# Altium project controller_V1.1.PrjPcb
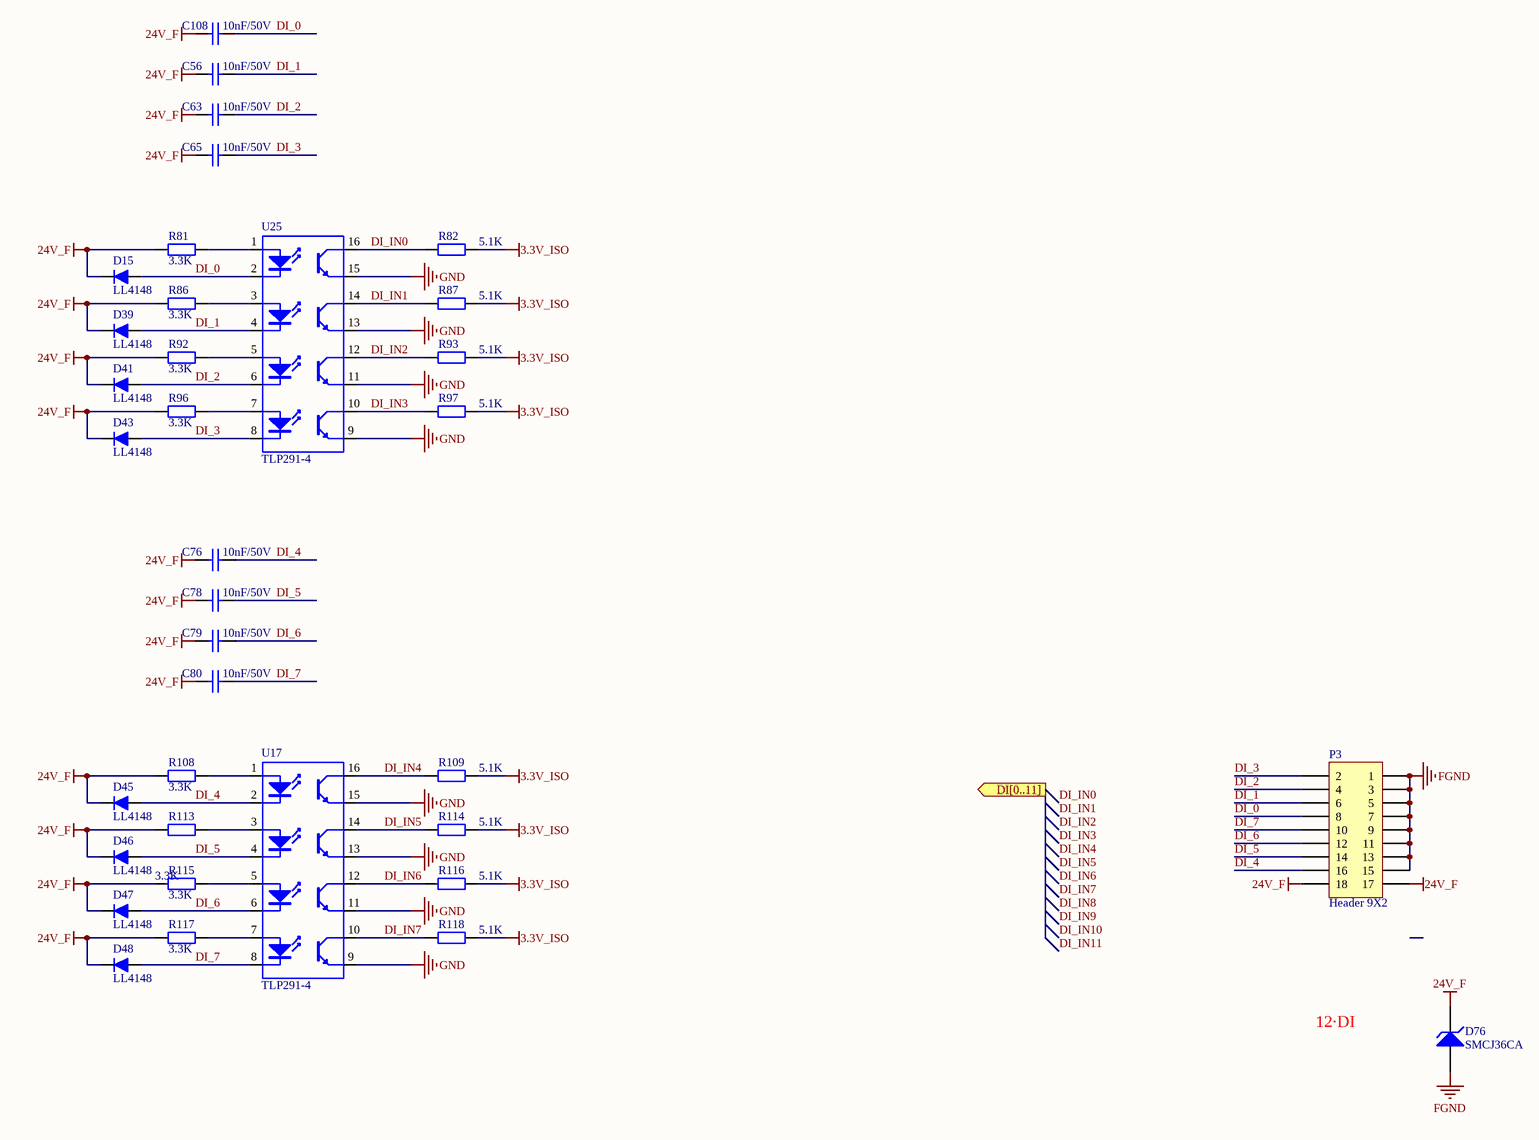
[diagram p0: di.SchDoc]
6 sheets, 311 parts. Net scope: global (net labels, ports and power ports of the same name join across sheets).
Board file: controller_V1.0.PcbDoc
Sheets:
  di.SchDoc
  do.SchDoc
  LTE.SchDoc
  power.SchDoc
  pt100.SchDoc
  rs485.SchDoc

## Sheet di.SchDoc
size A2

### Parts
C56  10nF/50V  [0603C]
C63  10nF/50V  [0603C]
C65  10nF/50V  [0603C]
C76  10nF/50V  [0603C]
C78  10nF/50V  [0603C]
C79  10nF/50V  [0603C]
C80  10nF/50V  [0603C]
C108  10nF/50V  [0603C]
D15  LL4148  [DO-213AB/LL34/MiniMELF]
D39  LL4148  [DO-213AB/LL34/MiniMELF]
D41  LL4148  [DO-213AB/LL34/MiniMELF]
D43  LL4148  [DO-213AB/LL34/MiniMELF]
D45  LL4148  [DO-213AB/LL34/MiniMELF]
D46  LL4148  [DO-213AB/LL34/MiniMELF]
D47  LL4148  [DO-213AB/LL34/MiniMELF]
D48  LL4148  [DO-213AB/LL34/MiniMELF]
D76  SMCJ36CA  [smc]
P3  Header 9X2  [XH2.54_2x9]
R81  3.3K  [0603R]
R82  5.1K  [0603R]
R86  3.3K  [0603R]
R87  5.1K  [0603R]
R92  3.3K  [0603R]
R93  5.1K  [0603R]
R96  3.3K  [0603R]
R97  5.1K  [0603R]
R108  3.3K  [0603R]
R109  5.1K  [0603R]
R113  3.3K  [0603R]
R114  5.1K  [0603R]
R115  3.3K  [0603R]
R116  5.1K  [0603R]
R117  3.3K  [0603R]
R118  5.1K  [0603R]
U17  TLP291-4  [SOP16-T]
U25  TLP291-4  [SOP16-T]

### Ports
DI[0..11] (out)

### Nets
3.3V_ISO: R82.1 R87.1 R93.1 R97.1 R109.1 R114.1 R116.1 R118.1
24V_F: C56.1 C63.1 C65.1 C76.1 C78.1 C79.1 C80.1 C108.1 D15.2(K) D39.2(K) D41.2(K) D43.2(K) D45.2(K) D46.2(K) D47.2(K) D48.2(K) D76.2(K) P3.17 P3.18 R81.2 R86.2 R92.2 R96.2 R108.2 R113.2 R115.2 R117.2
FGND: D76.1(A) P3.1 P3.3 P3.5 P3.7 P3.9 P3.11 P3.13 P3.15  [project net AGND]
GND: U17.9(E) U17.11(E) U17.13(E) U17.15(E) U25.9(E) U25.11(E) U25.13(E) U25.15(E)
DI_0: C108.2 D15.1(A) P3.8 U25.2(K)
DI_1: C56.2 D39.1(A) P3.6 U25.4(K)
DI_2: C63.2 D41.1(A) P3.4 U25.6(K)
DI_3: C65.2 D43.1(A) P3.2 U25.8(K)
DI_4: C76.2 D45.1(A) P3.16 U17.2(K)
DI_5: C78.2 D46.1(A) P3.14 U17.4(K)
DI_6: C79.2 D47.1(A) P3.12 U17.6(K)
DI_7: C80.2 D48.1(A) P3.10 U17.8(K)
DI_IN0: R82.2 U25.16(C)
DI_IN1: R87.2 U25.14(C)
DI_IN2: R93.2 U25.12(C)
DI_IN3: R97.2 U25.10(C)
DI_IN4: R109.2 U17.16(C)
DI_IN5: R114.2 U17.14(C)
DI_IN6: R116.2 U17.12(C)
DI_IN7: R118.2 U17.10(C)
NetR81_1: R81.1 U25.1(A)
NetR86_1: R86.1 U25.3(A)
NetR92_1: R92.1 U25.5(A)
NetR96_1: R96.1 U25.7(A)
NetR108_1: R108.1 U17.1(A)
NetR113_1: R113.1 U17.3(A)
NetR115_1: R115.1 U17.5(A)
NetR117_1: R117.1 U17.7(A)

### Notes on the sheet
- 12·DI
- Labels drawn without touching a wire or pin: DI_IN0, DI_IN1, DI_IN2, DI_IN3, DI_IN4, DI_IN5, DI_IN6, DI_IN7, DI_IN8, DI_IN9, DI_IN10, DI_IN11

### Library data of the parts
C56 C63 C65 C76 C78-C80 C108 = Cap: Capacitor; Value: 22nF; Published: 8-Jun-2000; LatestRevisionDate: 17-Jul-2002; LatestRevisionNote: Re-released for DXP Platform.; PackageReference: RAD-0.3; Publisher: Altium Limited; PackageDescription: Radial Cap, Thru-Hole; 2 Leads; 0.3 in Pin Spacing
D15 D39 D41 D43 D45-D48 = LL4148: VISHAY,LL4148,圆柱体MiniMELF100V/2A,ROHS; 版本: V1.00; 名称: 快速开关二极管; 物料编号: APLLY; 制造商: VISHAY
D76 = D Zener: SMBJ36CA; Published: 8-Jun-2000; LatestRevisionDate: 17-Jul-2002; LatestRevisionNote: Re-released for DXP Platform.; PackageReference: DIODE-0.7; Publisher: Altium Limited
P3 = Header 9X2: Header, 9-Pin, Dual row; LatestRevisionDate: 17-Jul-2002; LatestRevisionNote: Re-released for DXP Platform.; Publisher: Altium Limited
R81 R82 R86 R87 R92 R93 R96 R97 R108 R109 R113-R118 = Res0805M
U17 U25 = TLP281-4

## Sheet do.SchDoc
size A2
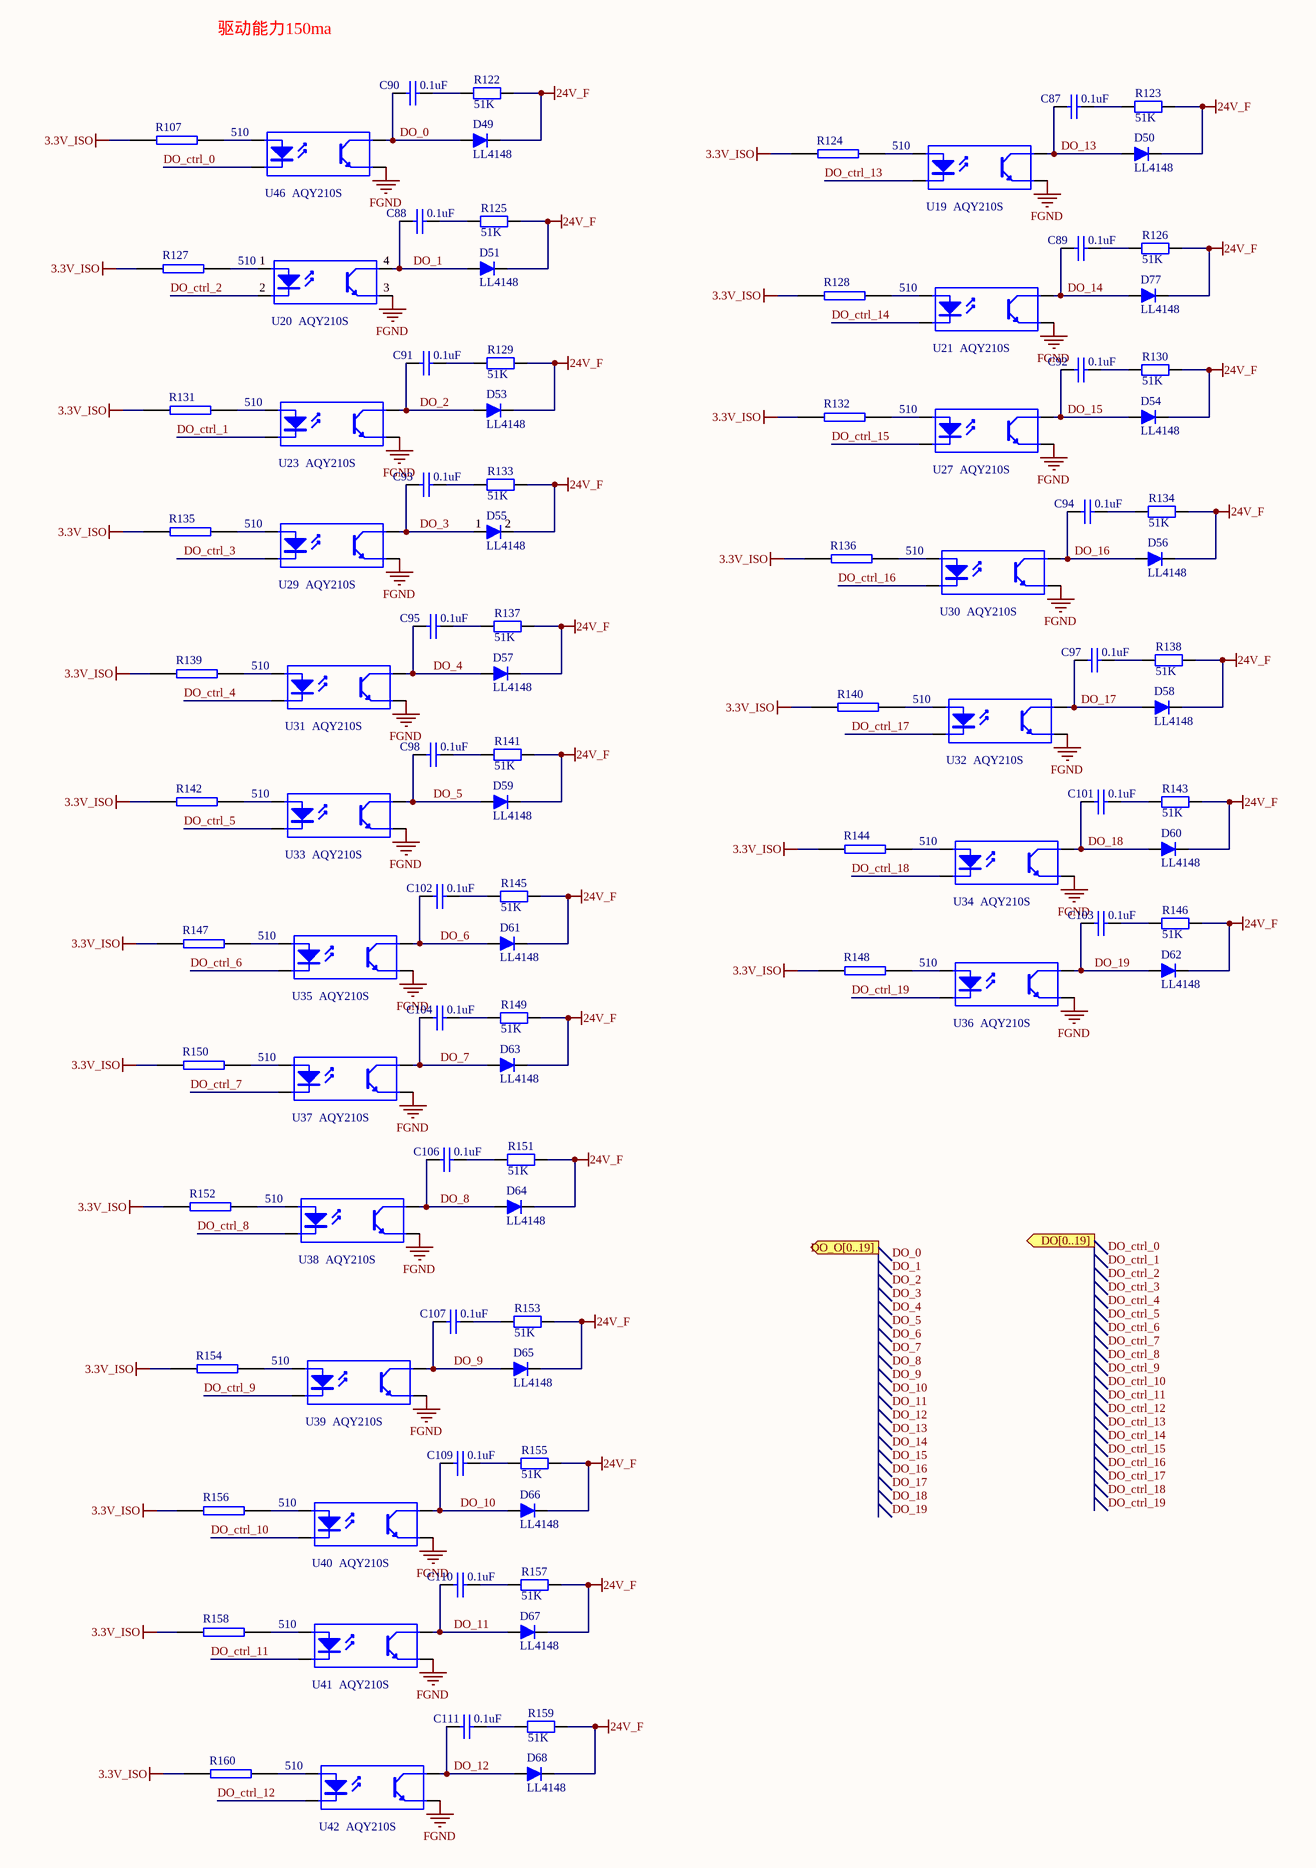
[diagram p1: do.SchDoc]

### Parts
C87  0.1uF  [0603C]
C88  0.1uF  [0603C]
C89  0.1uF  [0603C]
C90  0.1uF  [0603C]
C91  0.1uF  [0603C]
C92  0.1uF  [0603C]
C93  0.1uF  [0603C]
C94  0.1uF  [0603C]
C95  0.1uF  [0603C]
C97  0.1uF  [0603C]
C98  0.1uF  [0603C]
C101  0.1uF  [0603C]
C102  0.1uF  [0603C]
C103  0.1uF  [0603C]
C104  0.1uF  [0603C]
C106  0.1uF  [0603C]
C107  0.1uF  [0603C]
C109  0.1uF  [0603C]
C110  0.1uF  [0603C]
C111  0.1uF  [0603C]
D49  LL4148  [DO-213AB/LL34/MiniMELF]
D50  LL4148  [DO-213AB/LL34/MiniMELF]
D51  LL4148  [DO-213AB/LL34/MiniMELF]
D53  LL4148  [DO-213AB/LL34/MiniMELF]
D54  LL4148  [DO-213AB/LL34/MiniMELF]
D55  LL4148  [DO-213AB/LL34/MiniMELF]
D56  LL4148  [DO-213AB/LL34/MiniMELF]
D57  LL4148  [DO-213AB/LL34/MiniMELF]
D58  LL4148  [DO-213AB/LL34/MiniMELF]
D59  LL4148  [DO-213AB/LL34/MiniMELF]
D60  LL4148  [DO-213AB/LL34/MiniMELF]
D61  LL4148  [DO-213AB/LL34/MiniMELF]
D62  LL4148  [DO-213AB/LL34/MiniMELF]
D63  LL4148  [DO-213AB/LL34/MiniMELF]
D64  LL4148  [DO-213AB/LL34/MiniMELF]
D65  LL4148  [DO-213AB/LL34/MiniMELF]
D66  LL4148  [DO-213AB/LL34/MiniMELF]
D67  LL4148  [DO-213AB/LL34/MiniMELF]
D68  LL4148  [DO-213AB/LL34/MiniMELF]
D77  LL4148  [DO-213AB/LL34/MiniMELF]
R107  510  [0603R]
R122  51K  [0603R]
R123  51K  [0603R]
R124  510  [0603R]
R125  51K  [0603R]
R126  51K  [0603R]
R127  510  [0603R]
R128  510  [0603R]
R129  51K  [0603R]
R130  51K  [0603R]
R131  510  [0603R]
R132  510  [0603R]
R133  51K  [0603R]
R134  51K  [0603R]
R135  510  [0603R]
R136  510  [0603R]
R137  51K  [0603R]
R138  51K  [0603R]
R139  510  [0603R]
R140  510  [0603R]
R141  51K  [0603R]
R142  510  [0603R]
R143  51K  [0603R]
R144  510  [0603R]
R145  51K  [0603R]
R146  51K  [0603R]
R147  510  [0603R]
R148  510  [0603R]
R149  51K  [0603R]
R150  510  [0603R]
R151  51K  [0603R]
R152  510  [0603R]
R153  51K  [0603R]
R154  510  [0603R]
R155  51K  [0603R]
R156  510  [0603R]
R157  51K  [0603R]
R158  510  [0603R]
R159  51K  [0603R]
R160  510  [0603R]
U19  AQY210S  [sop4]
U20  AQY210S  [sop4]
U21  AQY210S  [sop4]
U23  AQY210S  [sop4]
U27  AQY210S  [sop4]
U29  AQY210S  [sop4]
U30  AQY210S  [sop4]
U31  AQY210S  [sop4]
U32  AQY210S  [sop4]
U33  AQY210S  [sop4]
U34  AQY210S  [sop4]
U35  AQY210S  [sop4]
U36  AQY210S  [sop4]
U37  AQY210S  [sop4]
U38  AQY210S  [sop4]
U39  AQY210S  [sop4]
U40  AQY210S  [sop4]
U41  AQY210S  [sop4]
U42  AQY210S  [sop4]
U46  AQY210S  [sop4]

### Ports
DO[0..19] (out), DO_O[0..19] (out)

### Nets
3.3V_ISO: R107.2 R124.2 R127.2 R128.2 R131.2 R132.2 R135.2 R136.2 R139.2 R140.2 R142.2 R144.2 R147.2 R148.2 R150.2 R152.2 R154.2 R156.2 R158.2 R160.2
24V_F: D49.2(K) D50.2(K) D51.2(K) D53.2(K) D54.2(K) D55.2(K) D56.2(K) D57.2(K) D58.2(K) D59.2(K) D60.2(K) D61.2(K) D62.2(K) D63.2(K) D64.2(K) D65.2(K) D66.2(K) D67.2(K) D68.2(K) D77.2(K) R122.2 R123.2 R125.2 R126.2 R129.2 R130.2 R133.2 R134.2 R137.2 R138.2 R141.2 R143.2 R145.2 R146.2 R149.2 R151.2 R153.2 R155.2 R157.2 R159.2
FGND: U19.3(E) U20.3(E) U21.3(E) U23.3(E) U27.3(E) U29.3(E) U30.3(E) U31.3(E) U32.3(E) U33.3(E) U34.3(E) U35.3(E) U36.3(E) U37.3(E) U38.3(E) U39.3(E) U40.3(E) U41.3(E) U42.3(E) U46.3(E)  [project net AGND]
DO_0: C90.1 D49.1(A) U46.4(C)
DO_1: C88.1 D51.1(A) U20.4(C)
DO_2: C91.1 D53.1(A) U23.4(C)
DO_3: C93.1 D55.1(A) U29.4(C)
DO_4: C95.1 D57.1(A) U31.4(C)
DO_5: C98.1 D59.1(A) U33.4(C)
DO_6: C102.1 D61.1(A) U35.4(C)
DO_7: C104.1 D63.1(A) U37.4(C)
DO_8: C106.1 D64.1(A) U38.4(C)
DO_9: C107.1 D65.1(A) U39.4(C)
DO_10: C109.1 D66.1(A) U40.4(C)
DO_11: C110.1 D67.1(A) U41.4(C)
DO_12: C111.1 D68.1(A) U42.4(C)
DO_13: C87.1 D50.1(A) U19.4(C)
DO_14: C89.1 D77.1(A) U21.4(C)
DO_15: C92.1 D54.1(A) U27.4(C)
DO_16: C94.1 D56.1(A) U30.4(C)
DO_17: C97.1 D58.1(A) U32.4(C)
DO_18: C101.1 D60.1(A) U34.4(C)
DO_19: C103.1 D62.1(A) U36.4(C)
DO_ctrl_0: U46.2(K)
DO_ctrl_1: U23.2(K)
DO_ctrl_2: U20.2(K)
DO_ctrl_3: U29.2(K)
DO_ctrl_4: U31.2(K)
DO_ctrl_5: U33.2(K)
DO_ctrl_6: U35.2(K)
DO_ctrl_7: U37.2(K)
DO_ctrl_8: U38.2(K)
DO_ctrl_9: U39.2(K)
DO_ctrl_10: U40.2(K)
DO_ctrl_11: U41.2(K)
DO_ctrl_12: U42.2(K)
DO_ctrl_13: U19.2(K)
DO_ctrl_14: U21.2(K)
DO_ctrl_15: U27.2(K)
DO_ctrl_16: U30.2(K)
DO_ctrl_17: U32.2(K)
DO_ctrl_18: U34.2(K)
DO_ctrl_19: U36.2(K)
NetC87_2: C87.2 R123.1
NetC88_2: C88.2 R125.1
NetC89_2: C89.2 R126.1
NetC90_2: C90.2 R122.1
NetC91_2: C91.2 R129.1
NetC92_2: C92.2 R130.1
NetC93_2: C93.2 R133.1
NetC94_2: C94.2 R134.1
NetC95_2: C95.2 R137.1
NetC97_2: C97.2 R138.1
NetC98_2: C98.2 R141.1
NetC101_2: C101.2 R143.1
NetC102_2: C102.2 R145.1
NetC103_2: C103.2 R146.1
NetC104_2: C104.2 R149.1
NetC106_2: C106.2 R151.1
NetC107_2: C107.2 R153.1
NetC109_2: C109.2 R155.1
NetC110_2: C110.2 R157.1
NetC111_2: C111.2 R159.1
NetR107_1: R107.1 U46.1(A)
NetR124_1: R124.1 U19.1(A)
NetR127_1: R127.1 U20.1(A)
NetR128_1: R128.1 U21.1(A)
NetR131_1: R131.1 U23.1(A)
NetR132_1: R132.1 U27.1(A)
NetR135_1: R135.1 U29.1(A)
NetR136_1: R136.1 U30.1(A)
NetR139_1: R139.1 U31.1(A)
NetR140_1: R140.1 U32.1(A)
NetR142_1: R142.1 U33.1(A)
NetR144_1: R144.1 U34.1(A)
NetR147_1: R147.1 U35.1(A)
NetR148_1: R148.1 U36.1(A)
NetR150_1: R150.1 U37.1(A)
NetR152_1: R152.1 U38.1(A)
NetR154_1: R154.1 U39.1(A)
NetR156_1: R156.1 U40.1(A)
NetR158_1: R158.1 U41.1(A)
NetR160_1: R160.1 U42.1(A)

### Notes on the sheet
- 驱动能力150ma
- Labels drawn without touching a wire or pin: DO_0, DO_1, DO_2, DO_3, DO_4, DO_5, DO_6, DO_7, DO_8, DO_9, DO_10, DO_11, DO_12, DO_13, DO_14, DO_15, DO_16, DO_17, DO_18, DO_19, DO_ctrl_0, DO_ctrl_1, DO_ctrl_2, DO_ctrl_3, DO_ctrl_4, DO_ctrl_5, DO_ctrl_6, DO_ctrl_7, DO_ctrl_8, DO_ctrl_9, DO_ctrl_10, DO_ctrl_11, DO_ctrl_12, DO_ctrl_13, DO_ctrl_14, DO_ctrl_15, DO_ctrl_16, DO_ctrl_17, DO_ctrl_18, DO_ctrl_19

### Library data of the parts
C87-C95 C97 C98 C101-C104 C106 C107 C109-C111 = CAP: Capacitor
D49-D51 D53-D68 D77 = LL4148: as D15 on sheet di; 制造商: VISHAY
R107 R124 R127 R128 R131 R132 R135 R136 R139 R140 R142 R144 R147 R148 R150 R152 R154 R156 R158 R160 = RES2
R122 R123 R125 R126 R129 R130 R133 R134 R137 R138 R141 R143 R145 R146 R149 R151 R153 R155 R157 R159 = Res0805M
U19-U21 U23 U27 U29-U42 U46 = Optoisolator1: 4-Pin Phototransistor Optocoupler; Published: 24-Mar-1999; LatestRevisionDate: 04-Mar-2005; LatestRevisionNote: Sch pins 3 & 4 Swapped.; DatasheetVersion: Nov-2003; PackageReference: DIP-4; Publisher: Altium Limited

## Sheet LTE.SchDoc
size A3
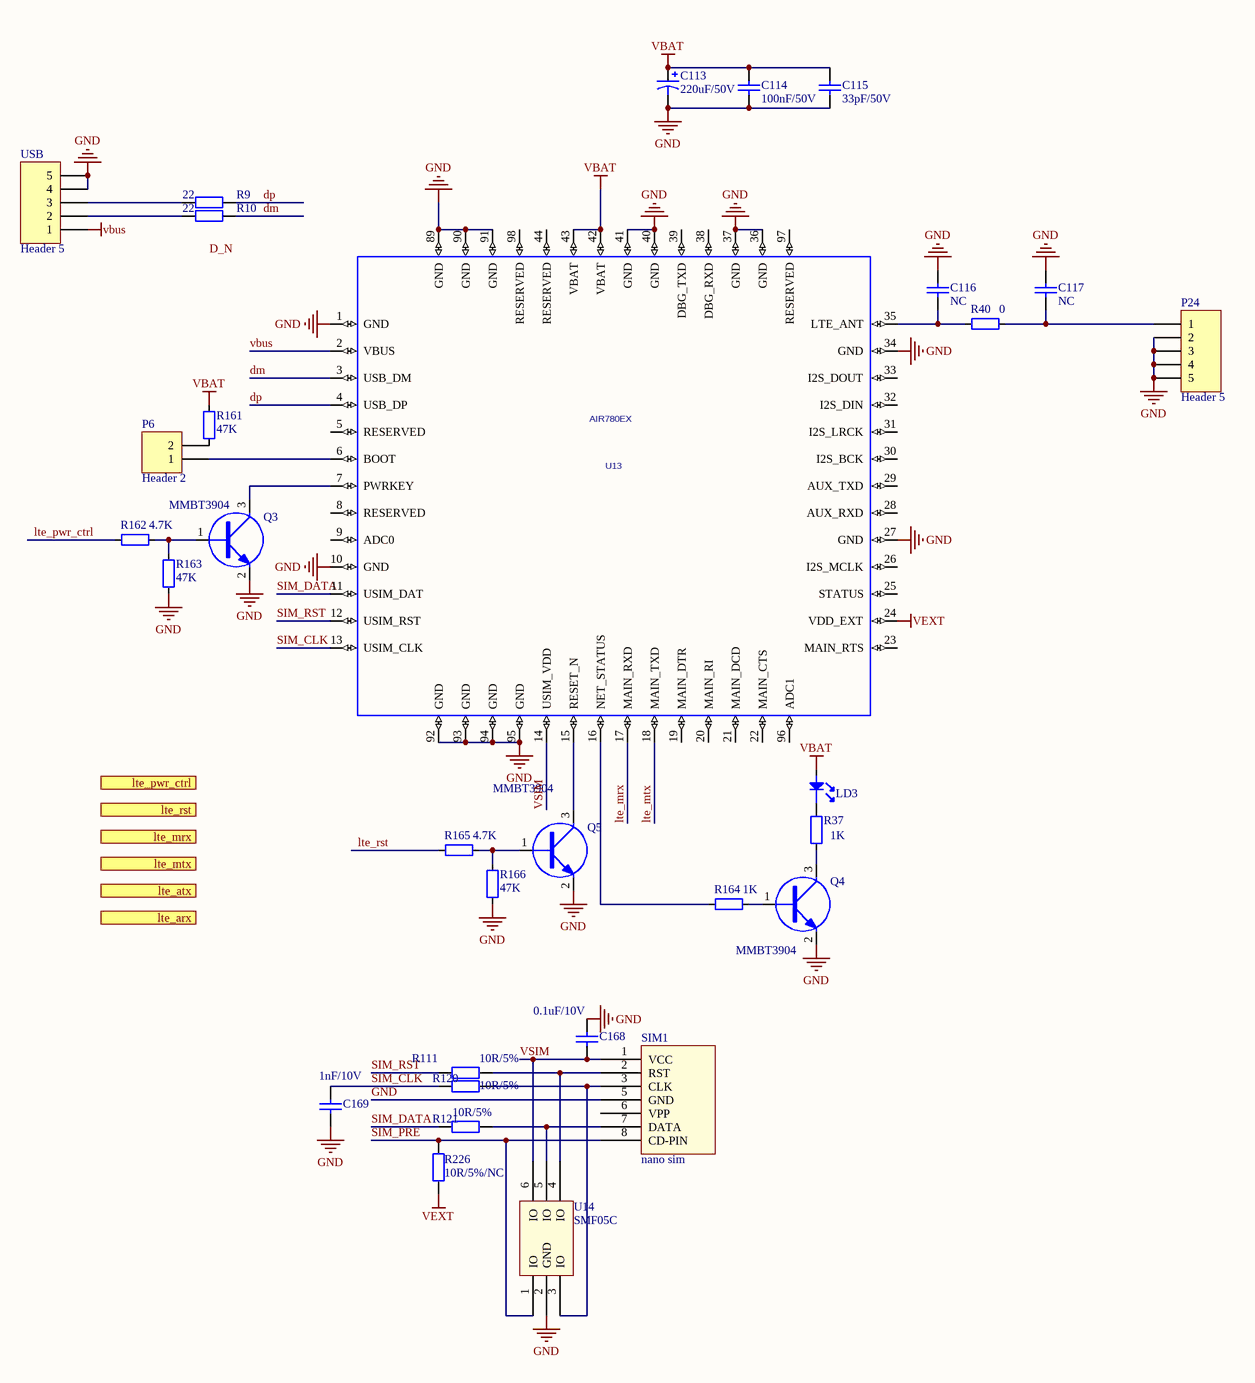
[diagram p2: LTE.SchDoc]

### Parts
C113  220uF/50V  [Φ10×10]
C114  100nF/50V  [0603C]
C115  33pF/50V  [0603C]
C116  NC  [0603c]
C117  NC  [0603c]
C168  0.1uF/10V  [0603c]
C169  1nF/10V  [0603c]
LD3  LED_Green_19-217  [0603led]  (value not drawn)
P6  Header 2  [HDR1X2]
P24  Header 5  [KH-SMA-KE-Z]
Q3  MMBT3904  [SOT23-3]
Q4  MMBT3904  [SOT23-3]
Q5  MMBT3904  [SOT23-3]
R9  22  [0402R]
R10  22  [0402R]
R37  1K  [0603R]
R40  0  [0603r]
R111  10R/5%  [0603r]
R120  10R/5%  [0603r]
R121  10R/5%  [0603r]
R161  47K  [0603r]
R162  4.7K  [0603R]
R163  47K  [0603r]
R164  1K  [0603r]
R165  4.7K  [0603R]
R166  47K  [0603r]
R226  10R/5%/NC  [0603r]
SIM1  nano sim  [Nano SIM]
U13  AIR780EX  [AIR780EX]
U14  SMF05C  [sc70-6l]
USB  Header 5  [USB-MICRO-5P]

### Ports
lte_arx, lte_atx, lte_mrx, lte_mtx, lte_pwr_ctrl, lte_rst

### Nets
GND: C113.2 C114.1 C115.1 C116.2 C117.2 C168.1 C169.2 P24.2 P24.3 P24.4 P24.5 Q3.2(E) Q4.2(E) Q5.2(E) R163.1 R166.1 SIM1.5(GND) U13.1(GND) U13.10(GND) U13.27(GND) U13.34(GND) U13.36(GND) U13.37(GND) U13.40(GND) U13.41(GND) U13.89(GND) U13.90(GND) U13.91(GND) U13.92(GND) U13.93(GND) U13.94(GND) U13.95(GND) U14.2(GND) USB.4 USB.5
VBAT: C113.1 C114.2 C115.2 LD3.1 R161.2 U13.42(VBAT) U13.43(VBAT)
vbus: U13.2(VBUS) USB.1
VEXT: R226.2 U13.24(VDD_EXT)
dm: R10.2 U13.3(USB_DM)
dp: R9.2 U13.4(USB_DP)
lte_mrx: U13.17(MAIN_RXD)
lte_mtx: U13.18(MAIN_TXD)
lte_pwr_ctrl: R162.1
lte_rst: R165.1
SIM_CLK: C169.1 R120.2 U13.13(USIM_CLK)
SIM_DATA: R121.2 U13.11(USIM_DAT)
SIM_PRE: R226.1 SIM1.8(CD-PIN) U14.1(IO)
SIM_RST: R111.2 U13.12(USIM_RST)
VSIM: C168.2 SIM1.1(VCC) U13.14(USIM_VDD) U14.6(IO)
NetC116_1: C116.1 R40.1 U13.35(LTE_ANT)
NetC117_1: C117.1 P24.1 R40.2
NetLD3_2: LD3.2 R37.1
NetP6_1: P6.1 U13.6(BOOT)
NetP6_2: P6.2 R161.1
NetQ3_1: Q3.1(B) R162.2 R163.2
NetQ3_3: Q3.3(C) U13.7(PWRKEY)
NetQ4_1: Q4.1(B) R164.2
NetQ4_3: Q4.3(C) R37.2
NetQ5_1: Q5.1(B) R165.2 R166.2
NetQ5_3: Q5.3(C) U13.15(RESET_N)
NetR9_1: R9.1 USB.3
NetR10_1: R10.1 USB.2
NetR111_1: R111.1 SIM1.2(RST) U14.4(IO)
NetR120_1: R120.1 SIM1.3(CLK) U14.3(IO)
NetR121_1: R121.1 SIM1.7(DATA) U14.5(IO)
NetR164_1: R164.1 U13.16(NET_STATUS)

Not connected (* = marked no-connect by the designer): SIM1 6(VPP); U13 5(RESERVED) 8(RESERVED) 9(ADC0) 19(MAIN_DTR) 20(MAIN_RI) 21(MAIN_DCD) 22(MAIN_CTS) 23(MAIN_RTS) 25(STATUS) 26(I2S_MCLK) 28(AUX_RXD) 29(AUX_TXD) 30(I2S_BCK) 31(I2S_LRCK) 32(I2S_DIN) 33(I2S_DOUT) 38(DBG_RXD) 39(DBG_TXD) 44(RESERVED) 96(ADC1) 97(RESERVED) 98(RESERVED)

### Notes on the sheet
- Labels drawn without touching a wire or pin: D_N

### Library data of the parts
C113 = Cap Pol1: Polarized Capacitor (Radial); Value: 100pF; Published: 8-Jun-2000; LatestRevisionDate: 17-Jul-2002; LatestRevisionNote: Re-released for DXP Platform.; PackageReference: RB7.6-15; Publisher: Altium Limited
C114-C117 = Cap: Capacitor; Value: 22nF; Published: 8-Jun-2000; LatestRevisionDate: 17-Jul-2002; LatestRevisionNote: Re-released for DXP Platform.; PackageReference: RAD-0.3; Publisher: Altium Limited; PackageDescription: Radial Cap, Thru-Hole; 2 Leads; 0.3 in Pin Spacing
C168 = Cap: Capacitor; Published: 8-Jun-2000; LatestRevisionDate: 17-Jul-2002; LatestRevisionNote: Re-released for DXP Platform.; PackageReference: RAD-0.3; Publisher: Altium Limited; Value: 0.1uF/10V
C169 = Cap: Capacitor; Value: 0.1uF/10V; Published: 8-Jun-2000; LatestRevisionDate: 17-Jul-2002; LatestRevisionNote: Re-released for DXP Platform.; PackageReference: RAD-0.3; Publisher: Altium Limited
LD3 = LED_Green_19-217: 物料主编码(PN): 100000032; Value: 19-217/G7C-AN1P2/3T; ID: 6; 序号: 33; 物料名称: 绿色LED; 物料描述: Other,LED,绿色,0603,1.6X0.8X0.4mm,19-217/G7C-AN1P2/3T; 工作温度: –40°C to 85°C; 制造商: Everlight; 器件等级: ——; 物料类型: 特殊二极管; 规格型号(完整型号): 19-217/G7C-AN1P2/3T
P6 = Header 2: Header, 2-Pin; LatestRevisionDate: 17-Jul-2002; LatestRevisionNote: Re-released for DXP Platform.; Publisher: Altium Limited
P24 USB = Header 5: Header, 5-Pin; LatestRevisionDate: 17-Jul-2002; LatestRevisionNote: Re-released for DXP Platform.; Publisher: Altium Limited
Q3-Q5 = NPN_MMBT3904
R9 R10 = Resistor: Resistor SMD - IEC symbol version; Value: NC; LatestRevisionDate: 27-Jul-20  -  Semtech
R37 R164 = RES0603: 物料主编码(PN): 150000040; ID: 233; 序号: 109; 物料名称: 贴片电阻; 精度: ±1%; 规格型号(完整型号): RC1608F103CS/RC0603FR-0710KL; 物料描述: RES,贴片电阻,0603,10k,±1%,1/10W,1.6X0.8X0.45mm,RC1608F103CS/RC0603FR-0710KL; 工作温度: –55°C to 155°C; 制造商: 三星/YAGEO; 器件等级: ——; 物料类型: 表贴电阻; 参数值: 1.00E+04; Value: 1K
R40 R161-R163 R165 R166 = RES0603: 物料主编码(PN): 150000040; Value: 1K; ID: 233; 序号: 109; 物料名称: 贴片电阻; 精度: ±1%; 规格型号(完整型号): RC1608F103CS/RC0603FR-0710KL; 物料描述: RES,贴片电阻,0603,10k,±1%,1/10W,1.6X0.8X0.45mm,RC1608F103CS/RC0603FR-0710KL; 工作温度: –55°C to 155°C; 制造商: 三星/YAGEO; 器件等级: ——; 物料类型: 表贴电阻; 参数值: 1.00E+04
R111 R120 R121 R226 = Res2: Resistor; Value: 10R; Published: 8-Jun-2000; LatestRevisionDate: 17-Jul-2002; LatestRevisionNote: Re-released for DXP Platform.; PackageReference: AXIAL-0.4; Publisher: Altium Limited
U13 = AIR780EX: PCB DECAL: AIR780EX

## Sheet power.SchDoc
size A2
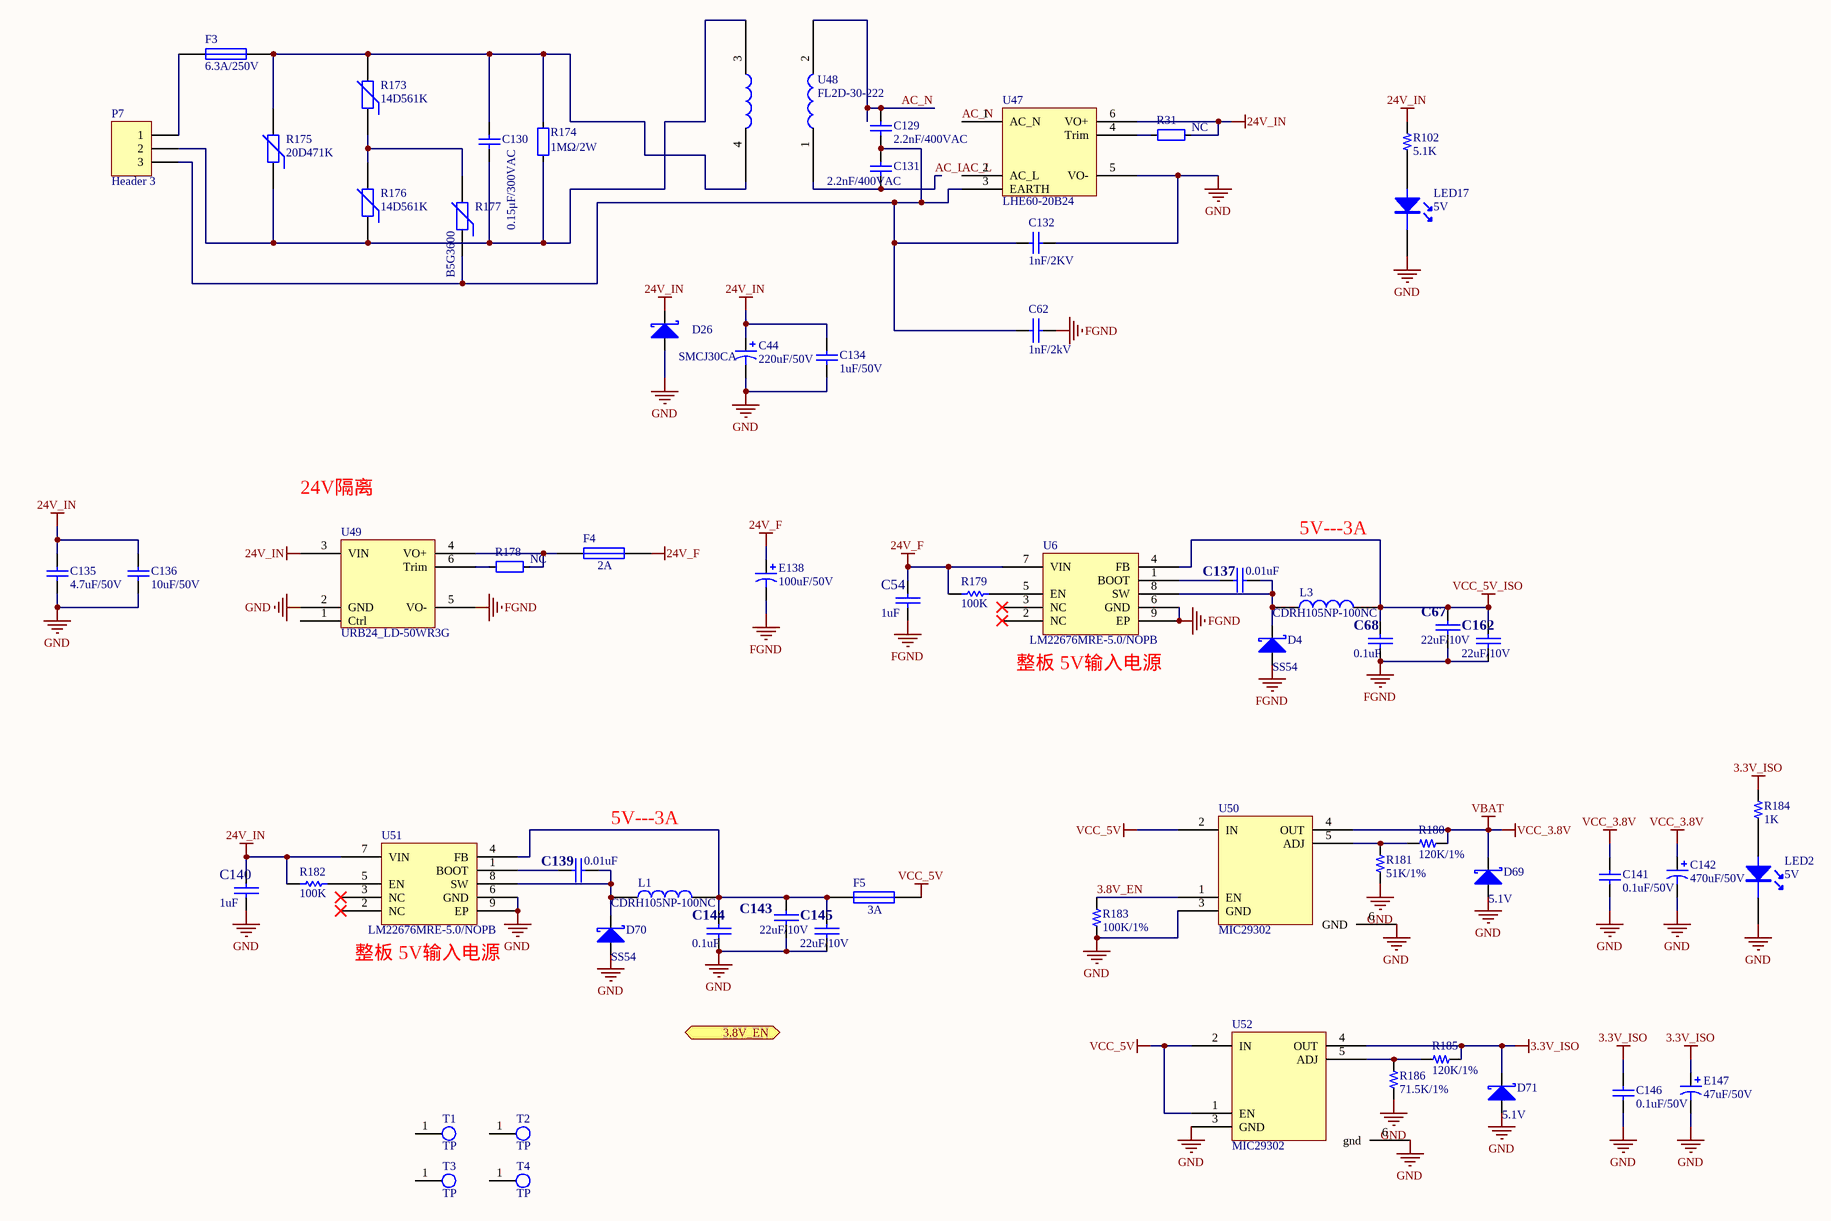
[diagram p3: power.SchDoc]

### Parts
C44  220uF/50V  [Φ10×10]
C54  1uF  [0603C]
C62  1nF/2kV  [1206C]
C67  22uF/10V  [1210C]
C68  0.1uF  [0603C]
C129  2.2nF/400VAC  [15x18]
C130  0.15μF/300VAC  [15x18]
C131  2.2nF/400VAC  [15x18]
C132  1nF/2KV  [1206C]
C134  1uF/50V  [1210C]
C135  4.7uF/50V  [1210C]
C136  10uF/50V  [1210C]
C137  0.01uF  [0603C]
C139  0.01uF  [0603C]
C140  1uF  [0603C]
C141  0.1uF/50V  [0603C]
C142  470uF/50V  [Φ10×10]
C143  22uF/10V  [1210C]
C144  0.1uF  [0603C]
C145  22uF/10V  [1210C]
C146  0.1uF/50V  [0603C]
C162  22uF/10V  [1210C]
D4  SS54  [SMC]
D26  SMCJ30CA  [SMC]
D69  5.1V  [SMA]
D70  SS54  [SMC]
D71  5.1V  [SMA]
E138  100uF/50V  [Φ10×10]
E147  47uF/50V  [Φ10×10]
F3  6.3A/250V  [可视开关电源保险丝座]
F4  2A  [1812-F]
F5  3A  [1812-F]
L1  CDRH105NP-100NC  [CDRH105]
L3  CDRH105NP-100NC  [CDRH105]
LED2  5V  [0603LED]
LED17  5V  [0603LED]
P7  Header 3  [KF128V-3P]
R31  NC  [0603r]
R102  5.1K  [0603R]
R173  14D561K  [14D561K]
R174  1MΩ/2W  [5x15.5]
R175  20D471K  [20D471K]
R176  14D561K  [14D561K]
R177  B5G3600  [B5G3600]
R178  NC  [0603r]
R179  100K  [0603R]
R180  120K/1%  [0603R]
R181  51K/1%  [0603R]
R182  100K  [0603R]
R183  100K/1%  [0603R]
R184  1K  [0603R]
R185  120K/1%  [0603R]
R186  71.5K/1%  [0603R]
T1  TP  [m2.5]
T2  TP  [m2.5]
T3  TP  [m2.5]
T4  TP  [m2.5]
U6  LM22676MRE-5.0/NOPB  [SOP127P600X168_HS-8N]
U47  LHE60-20B24  [LHE60-20B24]
U48  FL2D-30-222  [TY-100P]
U49  URB24_LD-50WR3G  [URB24_LD-50WR3G]
U50  MIC29302  [TO228P1435X457-6N]
U51  LM22676MRE-5.0/NOPB  [SOP127P600X168_HS-8N]
U52  MIC29302  [TO228P1435X457-6N]

### Ports
3.8V_EN (in)

### Nets
3.3V_ISO: C146.2 D71.2(K) E147.1 R184.2 R185.1 U52.4(OUT)
24V_F: C54.2 E138.1 F4.2 R179.2 U6.7(VIN)
24V_IN: C44.1 C134.2 C135.2 C136.2 C140.2 D26.2(K) R31.2 R102.2 R182.2 U47.6(VO+) U49.3(VIN) U51.7(VIN)
FGND: C54.1 C62.1 C67.2 C68.2 C162.2 D4.1(A) E138.2 U6.6(GND) U6.9(EP) U49.5(VO-)  [project net AGND]
GND: C44.2 C132.1 C134.1 C135.1 C136.1 C140.1 C141.1 C142.2 C143.2 C144.2 C145.2 C146.1 D26.1(A) D69.1(A) D70.1(A) D71.1(A) E147.2 LED2.2 LED17.2 R181.1 R183.1 R186.1 U47.5(VO-) U49.2(GND) U50.3(GND) U50.6(GND) U51.6(GND) U51.9(EP) U52.3(GND) U52.6(gnd)
VBAT: C141.2 C142.1 D69.2(K) R180.1 U50.4(OUT)  [also labelled VCC_3.8V]
VCC_5V: F5.2 U50.2(IN) U52.1(EN) U52.2(IN)
VCC_5V_ISO: C67.1 C68.1 C162.1 L3.2 U6.4(FB)
3.8V_EN: R183.2 U50.1(EN)
AC_L: C131.1 U47.2(AC_L) U48.1(L)
AC_N: C129.2 U47.1(AC_N) U48.2(L)
NetC62_2: C62.2 C129.1 C131.2 C132.2 P7.3 R177.1 U47.3(EARTH)
NetC130_1: C130.1 P7.2 R174.2 R175.1 R176.1 U48.3(L)
NetC130_2: C130.2 F3.2 R173.2 R174.1 R175.2 U48.4
NetC137_1: C137.1 D4.2(K) L3.1 U6.8(SW)
NetC137_2: C137.2 U6.1(BOOT)
NetC139_1: C139.1 D70.2(K) L1.1 U51.8(SW)
NetC139_2: C139.2 U51.1(BOOT)
NetC143_1: C143.1 C144.1 C145.1 F5.1 L1.2 U51.4(FB)
NetF3_1: F3.1 P7.1
NetF4_1: F4.1 R178.2 U49.4(VO+)
NetLED2_1: LED2.1 R184.1
NetLED17_1: LED17.1 R102.1
NetR31_1: R31.1 U47.4(Trim)
NetR173_1: R173.1 R176.2 R177.2
NetR178_1: R178.1 U49.6(Trim)
NetR179_1: R179.1 U6.5(EN)
NetR180_2: R180.2 R181.2 U50.5(ADJ)
NetR182_1: R182.1 U51.5(EN)
NetR185_2: R185.2 R186.2 U52.5(ADJ)

Not connected (* = marked no-connect by the designer): T1 1; T2 1; T3 1; T4 1; U6 2(NC)* 3(NC)*; U49 1(Ctrl); U51 2(NC)* 3(NC)*

### Notes on the sheet
- 24V隔离
- 5V---3A
- (near U6) 整板 5V输入电源
- (near U51) 整板 5V输入电源

### Library data of the parts
C44 = Cap Pol1: Polarized Capacitor (Radial); Published: 8-Jun-2000; LatestRevisionDate: 17-Jul-2002; LatestRevisionNote: Re-released for DXP Platform.; PackageReference: RB7.6-15; Publisher: Altium Limited; Value: 220uF/50V
C54 C62 C67 C68 C137 C139 C140 C143-C145 C162 = CAP: Capacitor
C129-C132 C134-C136 C141 C146 = Cap: Capacitor; Value: 22nF; Published: 8-Jun-2000; LatestRevisionDate: 17-Jul-2002; LatestRevisionNote: Re-released for DXP Platform.; PackageReference: RAD-0.3; Publisher: Altium Limited; PackageDescription: Radial Cap, Thru-Hole; 2 Leads; 0.3 in Pin Spacing
C142 E138 E147 = Cap Pol1: as C113 on sheet LTE; Published: 8-Jun-2000; LatestRevisionDate: 17-Jul-2002; LatestRevisionNote: Re-released for DXP Platform.; PackageReference: RB7.6-15; Publisher: Altium Limited
D4 D26 D69-D71 = DIODE S: Schottky Diode
F3-F5 = Fuse 1: Fuse; Published: 8-Jun-2000; LatestRevisionDate: 17-Jul-2002; LatestRevisionNote: Re-released for DXP Platform.; PackageReference: PIN-W2/E2.8; Publisher: Altium Limited; PackageDescription: Thru-Hole; 2 Leads
L1 L3 = INDUCTOR
LED2 LED17 = LED
P7 = Header 3: Header, 3-Pin; LatestRevisionDate: 17-Jul-2002; LatestRevisionNote: Re-released for DXP Platform.; Publisher: Altium Limited
R31 R174 R178 = RES0603: 物料主编码(PN): 150000040; Value: 100K; ID: 233; 序号: 109; 物料名称: 贴片电阻; 精度: ±1%; 规格型号(完整型号): RC1608F103CS/RC0603FR-0710KL; 物料描述: RES,贴片电阻,0603,10k,±1%,1/10W,1.6X0.8X0.45mm,RC1608F103CS/RC0603FR-0710KL; 工作温度: –55°C to 155°C; 制造商: 三星/YAGEO; 器件等级: ——; 物料类型: 表贴电阻; 参数值: 1.00E+04
R102 R180 R181 R183-R186 = R
R173 R175-R177 = Res Varistor: Varistor (Voltage-Sensitive Resistor); Published: 24-Mar-1999; LatestRevisionDate: 29-May-2009; LatestRevisionNote: IPC-7351 Footprint Added.; PackageVersion: Mar-2003; PackageReference: 6-0805; Publisher: Altium Limited; PackageDescription: Chip Resistor 0805 Case Size; Code_IPC: RESC2012
R179 R182 = Res1: Resistor; Published: 8-Jun-2000; LatestRevisionDate: 17-Jul-2002; LatestRevisionNote: Re-released for DXP Platform.; PackageReference: AXIAL-0.3; Publisher: Altium Limited
U6 U51 = LM22676MR-5.0
U48 = TY-100P: PCB mounting filters

## Sheet pt100.SchDoc
size A2
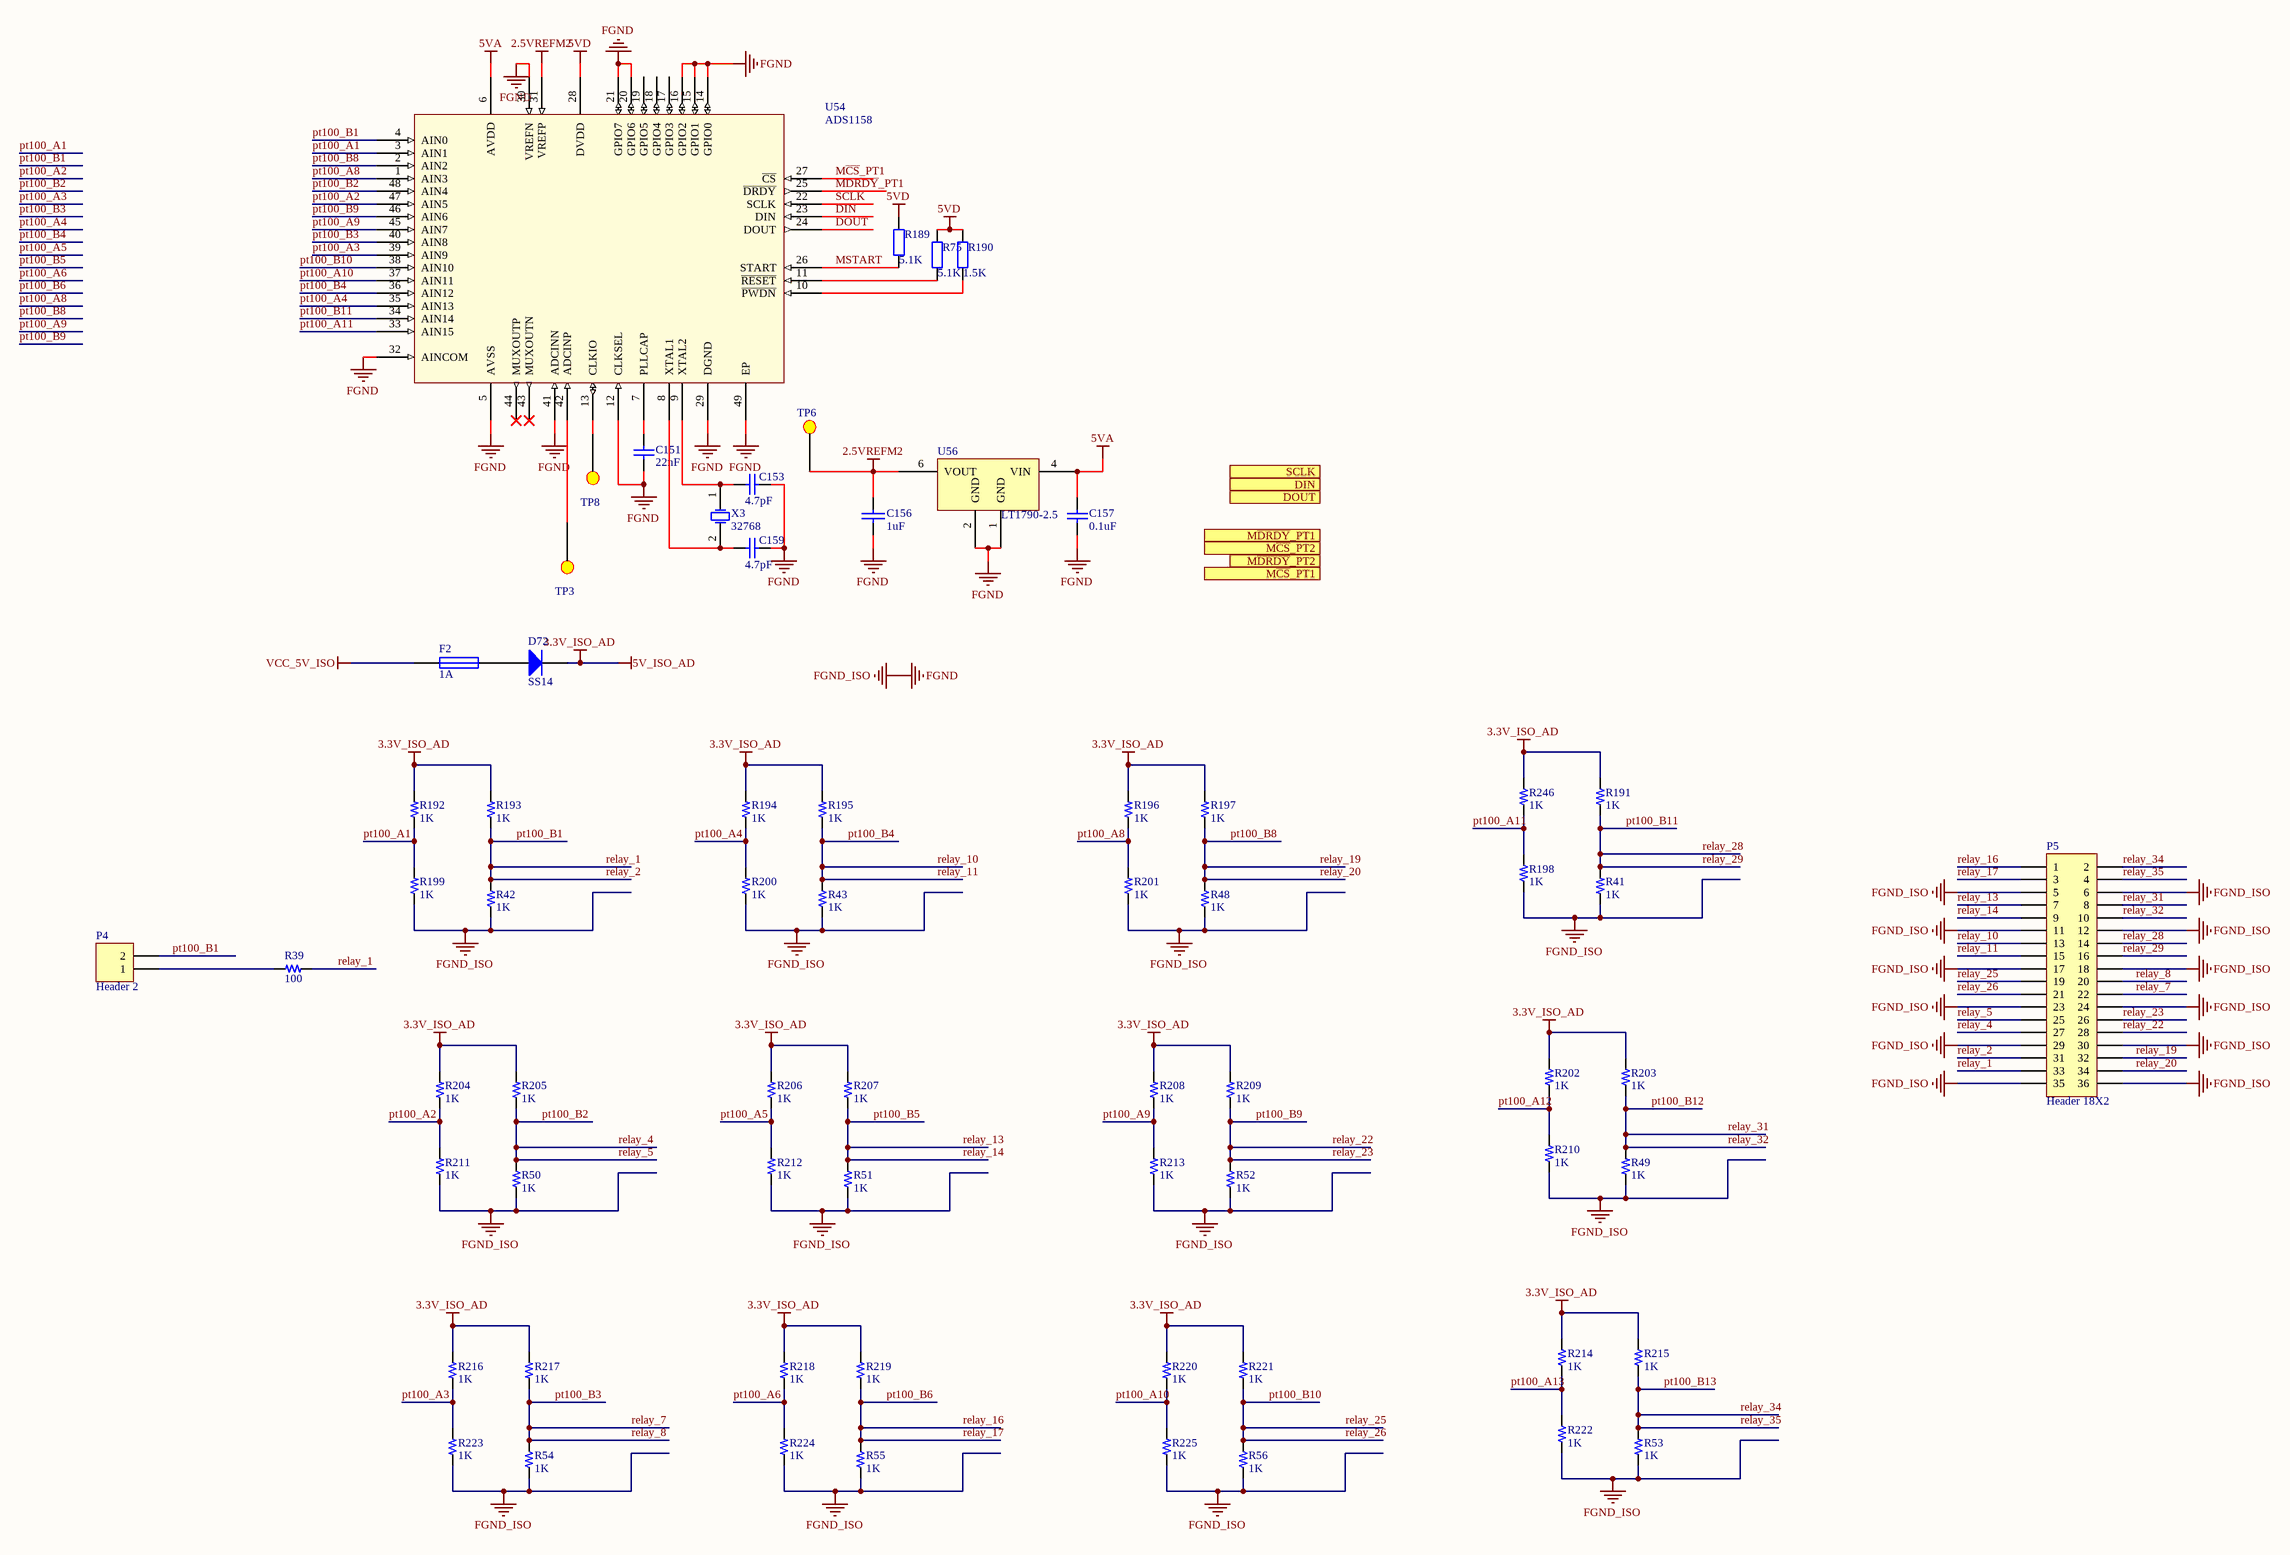
[diagram p4: pt100.SchDoc]

### Parts
C151  22nF  [0805C]
C153  4.7pF  [0603C]
C156  1uF  [0603C]
C157  0.1uF  [0603C]
C159  4.7pF  [0603C]
D72  SS14  [DO-214AC]
F2  1A  [0805r]
P4  Header 2  [HDR1X2]
P5  Header 18X2  [XH2.54_2x18]
R39  100  [0603R]
R41  1K  [0603R]
R42  1K  [0603R]
R43  1K  [0603R]
R48  1K  [0603R]
R49  1K  [0603R]
R50  1K  [0603R]
R51  1K  [0603R]
R52  1K  [0603R]
R53  1K  [0603R]
R54  1K  [0603R]
R55  1K  [0603R]
R56  1K  [0603R]
R75  5.1K  [0603R]
R189  5.1K  [0603R]
R190  1.5K  [0603R]
R191  1K  [0603R]
R192  1K  [0603R]
R193  1K  [0603R]
R194  1K  [0603R]
R195  1K  [0603R]
R196  1K  [0603R]
R197  1K  [0603R]
R198  1K  [0603R]
R199  1K  [0603R]
R200  1K  [0603R]
R201  1K  [0603R]
R202  1K  [0603R]
R203  1K  [0603R]
R204  1K  [0603R]
R205  1K  [0603R]
R206  1K  [0603R]
R207  1K  [0603R]
R208  1K  [0603R]
R209  1K  [0603R]
R210  1K  [0603R]
R211  1K  [0603R]
R212  1K  [0603R]
R213  1K  [0603R]
R214  1K  [0603R]
R215  1K  [0603R]
R216  1K  [0603R]
R217  1K  [0603R]
R218  1K  [0603R]
R219  1K  [0603R]
R220  1K  [0603R]
R221  1K  [0603R]
R222  1K  [0603R]
R223  1K  [0603R]
R224  1K  [0603R]
R225  1K  [0603R]
R246  1K  [0603R]
TP3  TEST_POINT  [TPD]  (value not drawn)
TP6  TEST_POINT  [TPD]  (value not drawn)
TP8  TEST_POINT  [TPD]  (value not drawn)
U54  ADS1158  [S-PVFQN-N48]
U56  LT1790-2.5  [SOT23-6]
X3  32768  [A]

### Ports
DIN (in), DOUT (out), M~{CS}_PT1 (out), M~{CS}_PT2 (out), M~{DRDY}_PT1 (out), M~{DRDY}_PT2 (out), SCLK (in)

### Nets
2.5VREFM2: C156.1 TP6.1 U54.31(VREFP) U56.6(VOUT)
3.3V_ISO_AD: D72.2(K) R191.2 R192.2 R193.2 R194.2 R195.2 R196.2 R197.2 R202.2 R203.2 R204.2 R205.2 R206.2 R207.2 R208.2 R209.2 R214.2 R215.2 R216.2 R217.2 R218.2 R219.2 R220.2 R221.2 R246.2  [also labelled 5V_ISO_AD]
5VA: C157.2 U54.6(AVDD) U56.4(VIN)
5VD: R75.1 R189.1 R190.1 U54.28(DVDD)
FGND: C151.2 C153.2 C156.2 C157.1 C159.2 P5.5 P5.6 P5.11 P5.12 P5.17 P5.18 P5.23 P5.24 P5.29 P5.30 P5.35 P5.36 R41.1 R42.1 R43.1 R48.1 R49.1 R50.1 R51.1 R52.1 R53.1 R54.1 R55.1 R56.1 R198.1 R199.1 R200.1 R201.1 R210.1 R211.1 R212.1 R213.1 R222.1 R223.1 R224.1 R225.1 U54.5(AVSS) U54.12(CLKSEL) U54.14(GPIO0) U54.15(GPIO1) U54.16(GPIO2) U54.20(GPIO6) U54.21(GPIO7) U54.29(DGND) U54.30(VREFN) U54.32(AINCOM) U54.41(ADCINN) U54.49(EP) U56.1(GND) U56.2(GND)  [also labelled FGND_ISO]  [project net AGND]
VCC_5V_ISO: F2.1
DIN: U54.23(DIN)
DOUT: U54.24(DOUT)
M~{CS}_PT1: U54.27(~{CS})
M~{DRDY}_PT1: U54.25(~{DRDY})
MSTART: R189.2 U54.26(START)
pt100_A1: R192.1 R199.2 U54.3(AIN1)
pt100_A2: R204.1 R211.2 U54.47(AIN5)
pt100_A3: R216.1 R223.2 U54.39(AIN9)
pt100_A4: R194.1 R200.2 U54.35(AIN13)
pt100_A5: R206.1 R212.2
pt100_A6: R218.1 R224.2
pt100_A8: R196.1 R201.2 U54.1(AIN3)
pt100_A9: R208.1 R213.2 U54.45(AIN7)
pt100_A10: R220.1 R225.2 U54.37(AIN11)
pt100_A11: R198.2 R246.1 U54.33(AIN15)
pt100_A12: R202.1 R210.2
pt100_A13: R214.1 R222.2
pt100_B1: P4.2 P5.31 P5.33 R39.1 R42.2 R193.1 U54.4(AIN0)  [also labelled relay_1, relay_2]
pt100_B2: P5.25 P5.27 R50.2 R205.1 U54.48(AIN4)  [also labelled relay_4, relay_5]
pt100_B3: P5.20 P5.22 R54.2 R217.1 U54.40(AIN8)  [also labelled relay_7, relay_8]
pt100_B4: P5.13 P5.15 R43.2 R195.1 U54.36(AIN12)  [also labelled relay_10, relay_11]
pt100_B5: P5.7 P5.9 R51.2 R207.1  [also labelled relay_13, relay_14]
pt100_B6: P5.1 P5.3 R55.2 R219.1  [also labelled relay_16, relay_17]
pt100_B8: P5.32 P5.34 R48.2 R197.1 U54.2(AIN2)  [also labelled relay_19, relay_20]
pt100_B9: P5.26 P5.28 R52.2 R209.1 U54.46(AIN6)  [also labelled relay_22, relay_23]
pt100_B10: P5.19 P5.21 R56.2 R221.1 U54.38(AIN10)  [also labelled relay_25, relay_26]
pt100_B11: P5.14 P5.16 R41.2 R191.1 U54.34(AIN14)  [also labelled relay_28, relay_29]
pt100_B12: P5.8 P5.10 R49.2 R203.1  [also labelled relay_31, relay_32]
pt100_B13: P5.2 P5.4 R53.2 R215.1  [also labelled relay_34, relay_35]
SCLK: U54.22(SCLK)
NetC151_1: C151.1 U54.7(PLLCAP)
NetC153_1: C153.1 U54.9(XTAL2) X3.1(OSC1)
NetC159_1: C159.1 U54.8(XTAL1) X3.2(OSC2)
NetD72_1: D72.1(A) F2.2
NetP4_1: P4.1 R39.2
NetR75_2: R75.2 U54.11(~{RESET})
NetR190_2: R190.2 U54.10(~{PWDN})
NetTP3_1: TP3.1 U54.42(ADCINP)
NetTP8_1: TP8.1 U54.13(CLKIO)

Not connected (* = marked no-connect by the designer): U54 17(GPIO3) 18(GPIO4) 19(GPIO5) 43(MUXOUTN)* 44(MUXOUTP)*; U56 3(DNC) 5(DNC)

### Library data of the parts
C151 C153 C157 = Cap: Capacitor; Published: 8-Jun-2000; LatestRevisionDate: 17-Jul-2002; LatestRevisionNote: Re-released for DXP Platform.; PackageReference: RAD-0.3; Publisher: Altium Limited; PackageDescription: Radial Cap, Thru-Hole; 2 Leads; 0.3 in Pin Spacing
  C157: Value: 0.1uF
C156 = CAP: Capacitor
C159 = Cap: Capacitor; Value: 6.8pF; Published: 8-Jun-2000; LatestRevisionDate: 17-Jul-2002; LatestRevisionNote: Re-released for DXP Platform.; PackageReference: RAD-0.3; Publisher: Altium Limited; PackageDescription: Radial Cap, Thru-Hole; 2 Leads; 0.3 in Pin Spacing
D72 = Diode: Default Diode; Published: 8-Jun-2000; LatestRevisionDate: 17-Jul-2002; LatestRevisionNote: Re-released for DXP Platform.; PackageVersion: Sep-1996; PackageReference: SMC; Publisher: Altium Limited; Code_JEDEC: DO-214-AB
F2 = Fuse 1: Fuse; Published: 8-Jun-2000; LatestRevisionDate: 17-Jul-2002; LatestRevisionNote: Re-released for DXP Platform.; PackageReference: PIN-W2/E2.8; Publisher: Altium Limited; PackageDescription: Thru-Hole; 2 Leads
P4 = Header 2: Header, 2-Pin; LatestRevisionDate: 17-Jul-2002; LatestRevisionNote: Re-released for DXP Platform.; Publisher: Altium Limited
P5 = Header 18X2: Header, 18-Pin, Dual row; LatestRevisionDate: 17-Jul-2002; LatestRevisionNote: Re-released for DXP Platform.; Publisher: Altium Limited
R39 R41-R43 R48-R56 R191-R225 R246 = R
R75 R189 R190 = Res0805M
U54 = ADS1158: 16-Channel, 16-Bit Analog-to-Digital Converter
U56 = LT1790-2.5: 2.5V Micropower SOT-23  Low Dropout Reference
X3 = XTAL: Crystal Oscillator; Published: 8-Jun-2000; LatestRevisionDate: 17-Jul-2002; LatestRevisionNote: Re-released for DXP Platform.; PackageReference: R38; Publisher: Altium Limited

## Sheet rs485.SchDoc
size A4
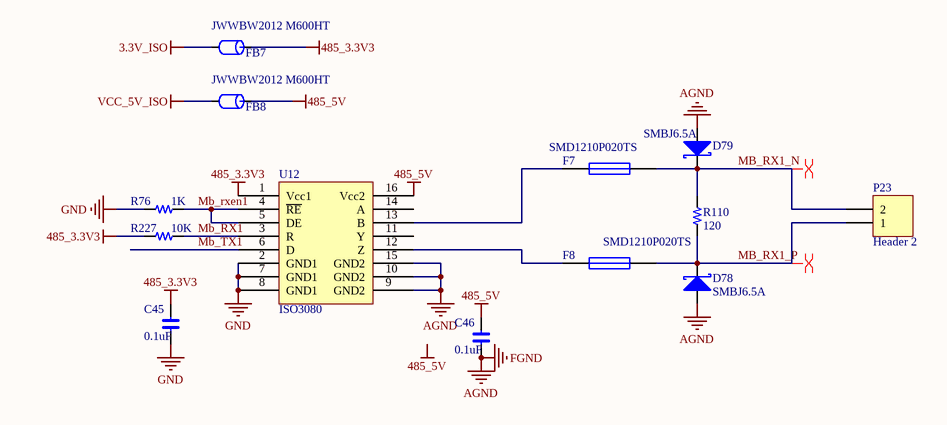
[diagram p5: rs485.SchDoc]

### Parts
C45  0.1uF  [0603C]
C46  0.1uF  [0603C]
D78  SMBJ6.5A  [SMB]
D79  SMBJ6.5A  [SMB]
F7  SMD1210P020TS  [1206R]
F8  SMD1210P020TS  [1206R]
FB7  JWWBW2012 M600HT  [0805CZ]
FB8  JWWBW2012 M600HT  [0805CZ]
P23  Header 2  [2X2.54MMZ]
R76  1K  [0603R]
R110  120  [0603R]
R227  10K  [0603R]
U12  ISO3080  [SO-16]

### Nets
3.3V_ISO: FB7.2
485_3.3V3: C45.2 FB7.1 R227.2 U12.1(Vcc1)
485_5V: C46.2 FB8.1 U12.16(Vcc2)
AGND: C46.1 D78.1(A) D79.1(A) U12.9(GND2) U12.10(GND2) U12.15(GND2)  [also labelled FGND]
GND: C45.1 R76.2 U12.2(GND1) U12.7(GND1) U12.8(GND1)
VCC_5V_ISO: FB8.2
Mb_RX1: R227.1 U12.3(R)
MB_RX1_N: D79.2(K) F7.2 P23.2 R110.1
MB_RX1_P: D78.2(K) F8.2 P23.1 R110.2
Mb_rxen1: R76.1 U12.4(~{RE}) U12.5(DE)
Mb_TX1: U12.6(D)
NetF7_1: F7.1 U12.13(B)
NetF8_1: F8.1 U12.12(Z)

Not connected (* = marked no-connect by the designer): U12 11(Y) 14(A)

### Layout directives
differential pair: MB_RX1_N, MB_RX1_P

### Notes on the sheet
- Labels drawn without touching a wire or pin: 485_5V

### Library data of the parts
C45 C46 = C
D78 D79 = DIODE S: Schottky Diode
F7 F8 = Fuse 1: Fuse; Published: 8-Jun-2000; LatestRevisionDate: 17-Jul-2002; LatestRevisionNote: Re-released for DXP Platform.; PackageReference: PIN-W2/E2.8; Publisher: Altium Limited
FB7 FB8 = FB: Part Field 1: 磁珠/0603/1K ohm/100MHz; FB: BLM18BD102SN1(muRata); Text Field1: FB
P23 = Header 2: Header, 2-Pin; LatestRevisionDate: 17-Jul-2002; LatestRevisionNote: Re-released for DXP Platform.; Publisher: Altium Limited
R76 R110 R227 = R

## Nets that join several sheets
3.3V_ISO: di (8 pins), do (20 pins), power (6 pins), rs485 (FB7.2)
24V_F: di (27 pins), do (40 pins), power (5 pins)
AGND: di (9 pins), do (20 pins), power (10 pins), pt100 (55 pins), rs485 (6 pins)
GND: di (8 pins), LTE (35 pins), power (30 pins), rs485 (5 pins)
VBAT: LTE (7 pins), power (5 pins)
VCC_5V_ISO: power (5 pins), pt100 (F2.1), rs485 (FB8.2)